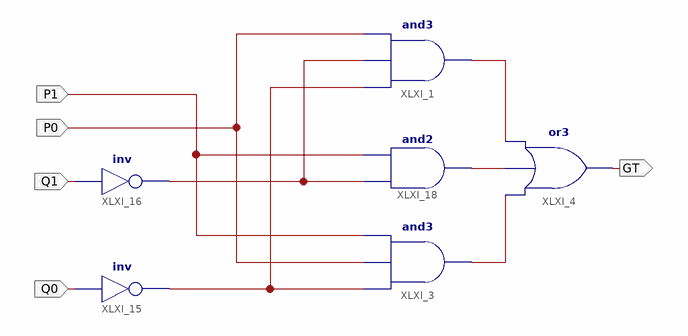
[diagram p0: schematic sheet 1]
// Xilinx ISE schematic circuit_simp.sch (spartan3e) as structural Verilog: 6 symbols, 5 ports
module circuit_simp (
  input  P1,
  input  P0,
  input  Q1,
  input  Q0,
  output GT
);

  wire XLXN_1, XLXN_2, XLXN_3, XLXN_5, XLXN_65;

  and XLXI_18 (XLXN_2, XLXN_65, P1);
  and XLXI_3 (XLXN_3, XLXN_5, P0, P1);
  and XLXI_1 (XLXN_1, XLXN_5, XLXN_65, P0);
  not XLXI_15 (XLXN_5, Q0);
  not XLXI_16 (XLXN_65, Q1);
  or XLXI_4 (GT, XLXN_3, XLXN_2, XLXN_1);
endmodule
